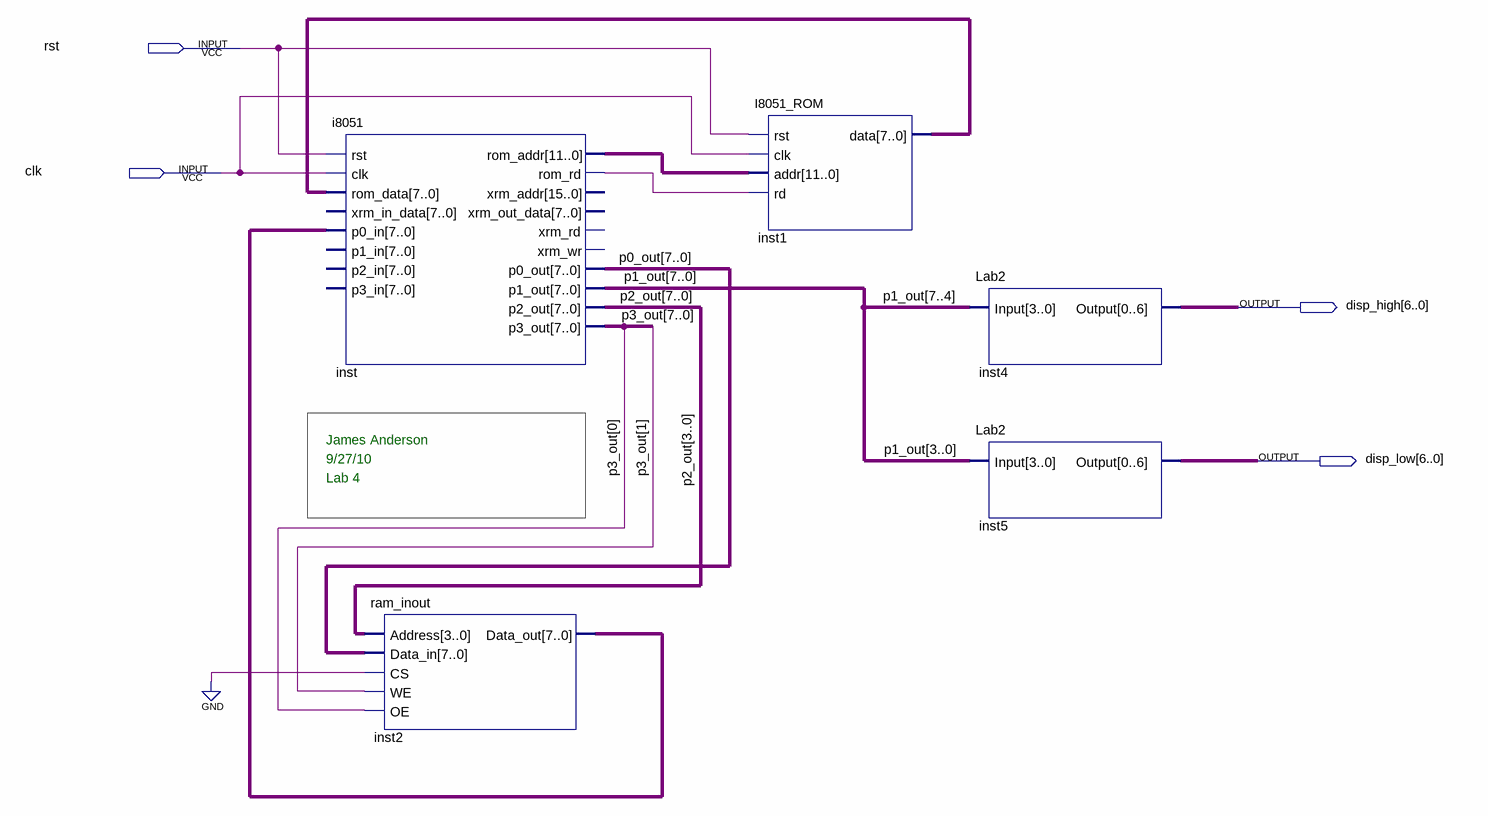
[diagram p0: schematic sheet]
// Quartus schematic Lab5_Top.bdf as structural Verilog: 5 symbols, 4 pins
module Lab5_Top (
  input  rst,
  input  clk,
  output [6:0] disp_high,
  output [6:0] disp_low
);

  wire inst_rom_rd;
  wire [7:0] inst1_data, inst2_data_out, p0_out, p1_out, p2_out, p3_out;
  wire [11:0] inst_rom_addr;

  i8051 inst (
    .rst(rst), .clk(clk), .rom_data(inst1_data), .p0_in(inst2_data_out), .rom_addr(inst_rom_addr),
    .rom_rd(inst_rom_rd), .p0_out(p0_out), .p1_out(p1_out), .p2_out(p2_out), .p3_out(p3_out));  // open: xrm_in_data, p1_in, p2_in, p3_in, xrm_addr, xrm_out_data, xrm_rd, xrm_wr
  ram_inout inst2 (
    .Address(p2_out[3:0]), .Data_in(p0_out), .CS(1'b0), .WE(p3_out[1]), .OE(p3_out[0]),
    .Data_out(inst2_data_out));
  I8051_ROM inst1 (.rst(rst), .clk(clk), .addr(inst_rom_addr), .rd(inst_rom_rd), .data(inst1_data));
  Lab2 inst4 (.Input(p1_out[7:4]), .Output(disp_high));
  Lab2 inst5 (.Input(p1_out[3:0]), .Output(disp_low));

  // Notes on the sheet:
  //   James Anderson
  //   9/27/10
  //   Lab 4
endmodule
